# Altium schematic sheet 00_Block_Diagram.SchDoc: Block Diagram
size A4; SheetNumber: 1; SheetTotal: 4
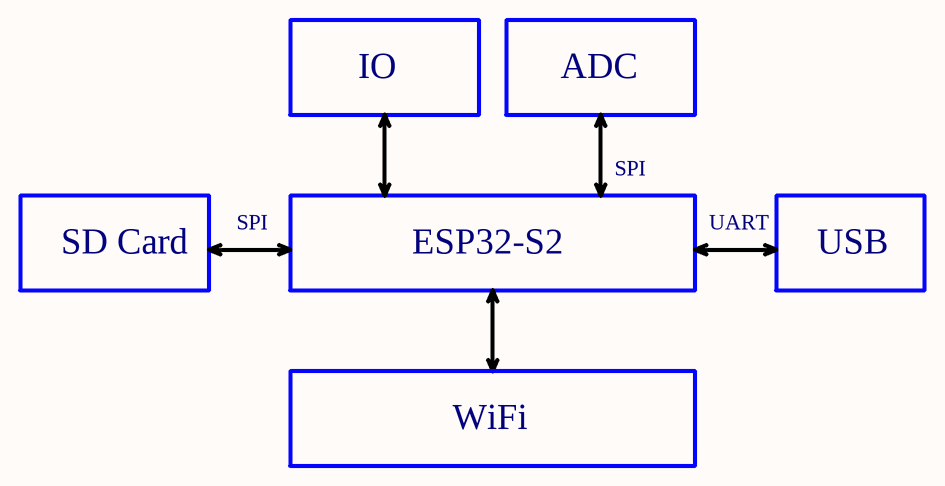
[diagram p0: 00_Block_Diagram.SchDoc]

## Notes on the sheet
- IO
- ADC
- SPI
- UART
- SD Card
- ESP32-S2
- USB
- WiFi
- APPROVALS
- DATE
- PROJECT
- BOM:
- REFERENCE DOCUMENTS
- TITLE
- PROJECT REVISION
- DOCUMENT REVISION
- ASSY DWG:
- FAB DWG:
- PCB DWG:
- SIZE:
- A4
- FILE NAME:
- REV
- SHEET
- OF